# EAGLE design SQUAREPOWERVerticalUSBCV1 (EAGLE 9.6.2)
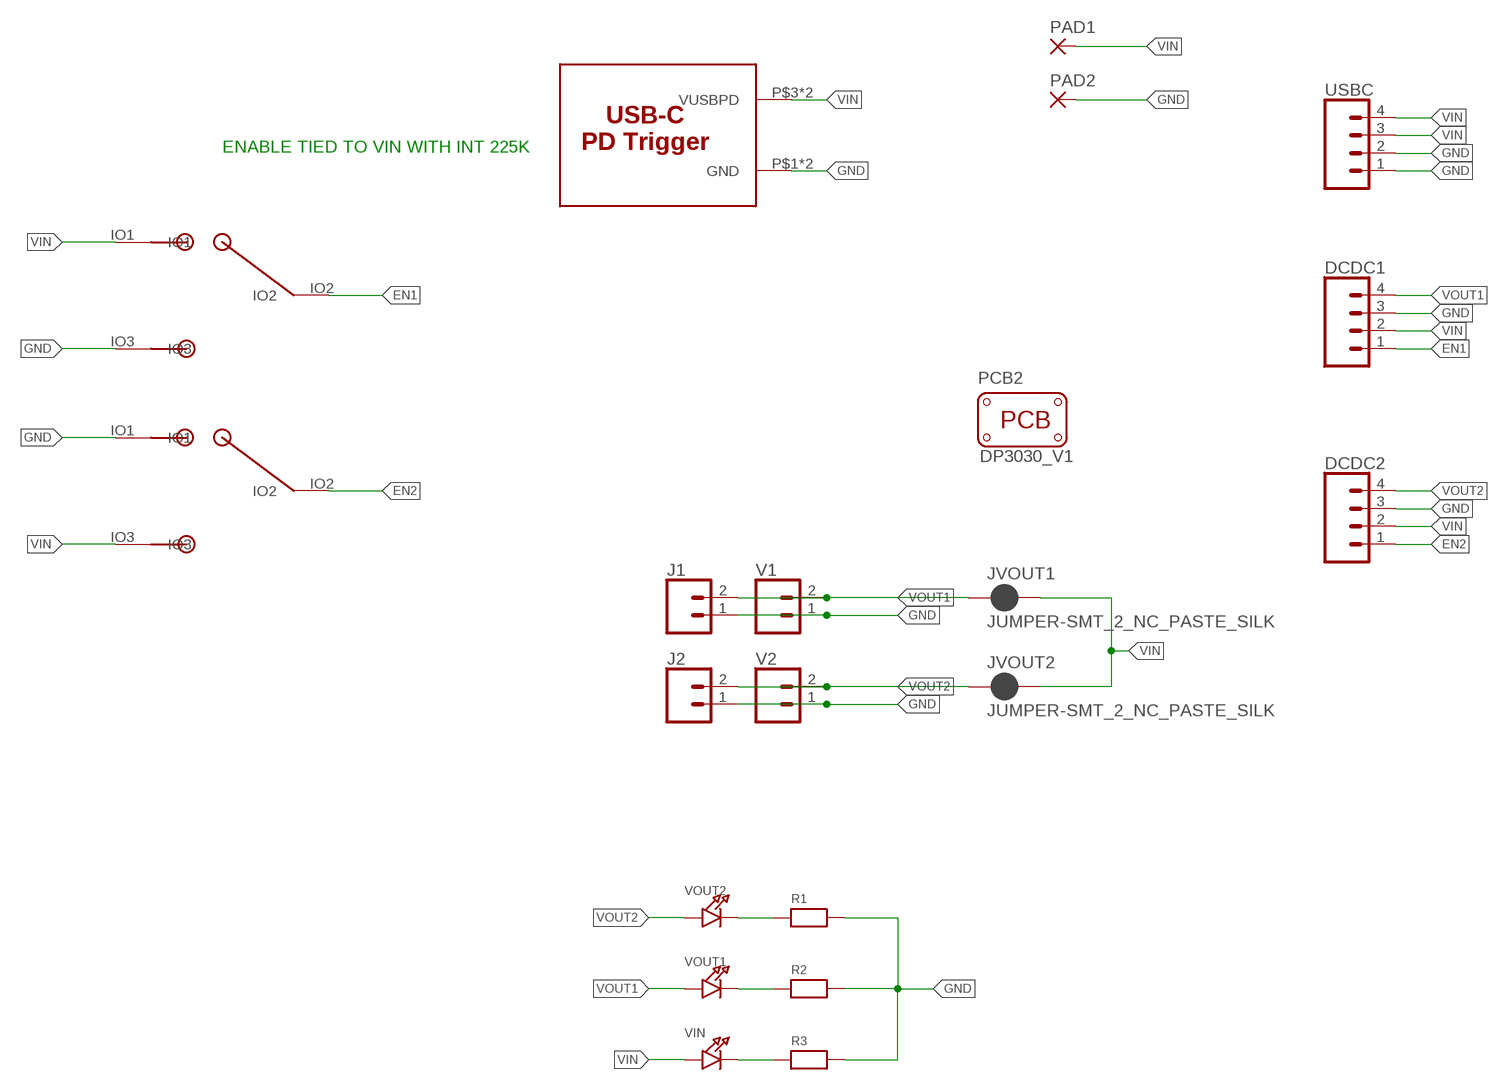
[diagram p0: schematic, sheet 1]

## Parts
DCDC1  CONN_04LONGPADS  [1X04_LONGPADS]
DCDC2  CONN_04LONGPADS  [1X04_LONGPADS]
J1  CONN_02  [1X02]
J2  CONN_02  [1X02]
JVOUT1  JUMPER-SMT_2_NC_PASTE_SILK  [SMT-JUMPER_2_NC_PASTE_SILK]
JVOUT2  JUMPER-SMT_2_NC_PASTE_SILK  [SMT-JUMPER_2_NC_PASTE_SILK]
PAD1  SMD5  [SMD2,54-5,08]
PAD2  SMD5  [SMD2,54-5,08]
PCB2  PCB_DP_SQUARE-3X3  [DP3030_V1]
R1  RESISTOR0805  [0805]
R2  RESISTOR0805  [0805]
R3  RESISTOR0805  [0805]
U$1  SPDT-SWITCH-MSKT-12C00  [MSKT-12C00]
U$2  SPDT-SWITCH-MSKT-12C00  [MSKT-12C00]
U$5  USB_PD_TRIGGER  [USB-PDTRIGGER]
USBC  CONN_04LONGPADS  [1X04_LONGPADS]
V1  CONN_023.5MM  [SCREWTERMINAL-3.5MM-2]
V2  CONN_023.5MM  [SCREWTERMINAL-3.5MM-2]
VIN  LED0805  [CHIPLED_0805]
VOUT1  LED0805  [CHIPLED_0805]
VOUT2  LED0805  [CHIPLED_0805]

## Nets
EN1: DCDC1.1 U$1.IO2
EN2: DCDC2.1 U$2.IO2
GND: DCDC1.3 DCDC2.3 J1.1 J2.1 PAD2.1(P) R1.2 R2.2 R3.2 U$1.IO3 U$2.IO1 U$5.P$1(GND) U$5.P$2(GND) USBC.1 USBC.2 V1.1 V2.1
N$1: R1.1 VOUT2.C
N$2: R2.1 VOUT1.C
N$3: R3.1 VIN.C
VIN: DCDC1.2 DCDC2.2 JVOUT1.2 JVOUT2.2 PAD1.1(P) U$1.IO1 U$2.IO3 U$5.P$3(VUSBPD) U$5.P$4(VUSBPD) USBC.3 USBC.4 VIN.A
VOUT1: DCDC1.4 J1.2 JVOUT1.1 V1.2 VOUT1.A
VOUT2: DCDC2.4 J2.2 JVOUT2.1 V2.2 VOUT2.A

## Notes on the sheet
- ENABLE TIED TO VIN WITH INT 225K

## Library data of the parts
DCDC1 DCDC2 USBC = SparkFun-Connectors:CONN_04: Multi connection point. Often used as Generic Header-pin footprint for 0.1 inch spaced/style header connections On any of the 0.1 inch spaced packages, you can populate with these: Break Away Headers - Straight <https://www.sparkfun.com/products/116> (PRT-00116) Break Away Male Headers - Right Angle <https://www.sparkfun.com/products/553> (PRT-00553) Female Headers <https://www.sparkfun.com/products/115> (PRT-00115) Break Away Headers - Machine Pin <https://www.sparkfun.com/products/117> (PRT-00117) Break Away Female Headers - Swiss Machine Pin <https://www.sparkfun.com/products/743> (PRT-00743) For SCREWTERMINALS and SPRING TERMINALS visit here: Screw Terimnals on SparkFun.com <https://www.sparkfun.com/search/results?term=Screw+Terminals> (5mm/3.5mm/2.54mm spacing) This device is also useful as a general connection point to wire up your design to another part of your project. Our various solder wires solder well into these plated through hole pads. Hook-Up Wire - Assortment (Stranded, 22 AWG) <https://www.sparkfun.com/products/11375> (PRT-11375) Hook-Up Wire - Assortment (Solid Core, 22 AWG) <https://www.sparkfun.com/products/11367> (PRT-11367) View the entire wire category on our website here <https://www.sparkfun.com/categories/141> Special notes: Molex polarized connector foot print use with SKU : PRT-08231 with associated crimp pins and housings. 1MM SMD Version SKU: PRT-10208; PROD_ID: CONN-09696
J1 J2 = SparkFun-Connectors:CONN_02: Multi connection point. Often used as Generic Header-pin footprint for 0.1 inch spaced/style header connections On any of the 0.1 inch spaced packages, you can populate with these: Break Away Headers - Straight <https://www.sparkfun.com/products/116> (PRT-00116) Break Away Male Headers - Right Angle <https://www.sparkfun.com/products/553> (PRT-00553) Female Headers <https://www.sparkfun.com/products/115> (PRT-00115) Break Away Headers - Machine Pin <https://www.sparkfun.com/products/117> (PRT-00117) Break Away Female Headers - Swiss Machine Pin <https://www.sparkfun.com/products/743> (PRT-00743) For SCREWTERMINALS and SPRING TERMINALS visit here: Screw Terimnals on SparkFun.com <https://www.sparkfun.com/search/results?term=Screw+Terminals> (5mm/3.5mm/2.54mm spacing) This device is also useful as a general connection point to wire up your design to another part of your project. Our various solder wires solder well into these plated through hole pads. Hook-Up Wire - Assortment (Stranded, 22 AWG) <https://www.sparkfun.com/products/11375> (PRT-11375) Hook-Up Wire - Assortment (Solid Core, 22 AWG) <https://www.sparkfun.com/products/11367> (PRT-11367) View the entire wire category on our website here <https://www.sparkfun.com/categories/141> Special notes: Molex polarized connector foot print use with: PRT-08233 with associated crimp pins and housings. 2.54_SCREWTERM for use with PRT-10571. 3.5mm Screw Terminal footprints for PRT-08084 5mm Screw Terminal footprints for use with PRT-08432
JVOUT1 JVOUT2 = SparkFun-Jumpers:JUMPER-SMT_2_NC_PASTE: Normally closed solder jumper This jumper has an aperture in the stencil to allow solder paste to bridge the split in the wire so it's normally closed (NC). Wick off the solder to open the connection. Reapply solder to reclose the connection.
PAD1 PAD2 = wirepad:SMD5: SMD PAD
PCB2 = dp_devices:PCB_DP_SQUARE: Dangerous Prototypes Standard Square PCB sizes; PCB_SIZE: DP3030_V1
R1-R3 = microbuilder:RESISTOR: Resistors 0402 - 0402 Surface Mount Package 22 Ohm 1% 1/16W [Digikey: 311-22.0LRTR-ND] 33 Ohm 5% 1/16W 1.0K 5% 1/16W 1.5K 5% 1/16W 2.0K 1% 1/16W 10.0K 1% 1/16W [Digikey: 311-10.0KLRTR-ND] 10.0K 5% 1/16W [Digikey: RMCF0402JT10K0TR-ND] 12.1K 1% 1/16W [Digikey: 311-22.0LRTR-ND] 100.0K 5% 1/16W 0603 - 0603 Surface Mount Package 0 Ohm 1/10 Watt 1% Resistor 15 Ohm 1/10 Watt 1% Resistor 33 Ohm 1/10 Watt 1% Resistor 49.9 Ohm 1/10 Watt 1% Resistor 100 Ohm 1/10 Watt 1% Resistor 150 Ohm 1/10 Watt 1% Resistor 240 Ohm 1/10 Watt 1% Resistor 390 Ohm 1/10 Watt 1% Resistor 560 Ohm 1/10 Watt 1% Resistor 680 Ohm 1/10 Watt 1% Resistor 750 Ohm 1/10 Watt 1% Resistor 1.0K Ohm 1/10 Watt 1% Resistor 1.5K Ohm 1/10 Watt 1% Resistor 2.0K Ohm 1/10 Watt 1% Resistor 2.2K Ohm 1/10 Watt 1% Resistor 3.3K Ohm 1/10 Watt 1% Resistor 4.7K Ohm 1/10 Watt 1% Resistor 10.0K Ohm 1/10 Watt 1% Resistor 12.0K Ohm 1/10 Watt 1% Resistor 12.1K Ohm 1/10 Watt 1% Resistor 20.0K Ohm 1/10 Watt 1% Resistor 33.0K Ohm 1/10 Watt 1% Resistor 100.0K Ohm 1/10 Watt 1% Resistor 0805 - 0805 Surface Mount Package 0 Ohm 1/8 Watt 1% Resistor 33 Ohm 1/8 Watt 1% Resistor 100 Ohm 1/8 Watt 1% Resistor 150 Ohm 1/8 Watt 1% Resistor 200 Ohm 1/8 Watt 1% Resistor 240 Ohm 1/8 Watt 1% Resistor 330 Ohm 1/8 Watt 1% Resistor 390 Ohm 1/8 Watt 1% Resistor 470 Ohm 1/8 Watt 1% Resistor 1.0K Ohm 1/8 Watt 1% Resistor 1.5K Ohm 1/8 Watt 1% Resistor 2.0K Ohm 1/8 Watt 1% Resistor 4.7K Ohm 1/8 Watt 1% Resistor 5.1K Ohm 1/8 Watt 1% Resistor 5.6K Ohm 1/8 Watt 1% Resistor 10.0K Ohm 1/8 Watt 1% Resistor 22.0K Ohm 1/8 Watt 1% Resistor 33.0K Ohm 1/8 Watt 1% Resistor 100K Ohm 1/8 Watt 1% Resistor 1206 - 1206 Surface Mount Package 2012 - 2010 Surface Mount Package 0.11 Ohm 1/2 Watt 1% Resistor - Digikey: RHM.11UCT-ND
U$1 U$2 = MyBreadBoards:SPDT-SWITCH-MSKT-12C00
U$5 = MyBreadBoards:USB_PD_TRIGGER
V1 V2 = SparkFun-Connectors:CONN_02: Multi connection point. Often used as Generic Header-pin footprint for 0.1 inch spaced/style header connections On any of the 0.1 inch spaced packages, you can populate with these: Break Away Headers - Straight <https://www.sparkfun.com/products/116> (PRT-00116) Break Away Male Headers - Right Angle <https://www.sparkfun.com/products/553> (PRT-00553) Female Headers <https://www.sparkfun.com/products/115> (PRT-00115) Break Away Headers - Machine Pin <https://www.sparkfun.com/products/117> (PRT-00117) Break Away Female Headers - Swiss Machine Pin <https://www.sparkfun.com/products/743> (PRT-00743) For SCREWTERMINALS and SPRING TERMINALS visit here: Screw Terimnals on SparkFun.com <https://www.sparkfun.com/search/results?term=Screw+Terminals> (5mm/3.5mm/2.54mm spacing) This device is also useful as a general connection point to wire up your design to another part of your project. Our various solder wires solder well into these plated through hole pads. Hook-Up Wire - Assortment (Stranded, 22 AWG) <https://www.sparkfun.com/products/11375> (PRT-11375) Hook-Up Wire - Assortment (Solid Core, 22 AWG) <https://www.sparkfun.com/products/11367> (PRT-11367) View the entire wire category on our website here <https://www.sparkfun.com/categories/141> Special notes: Molex polarized connector foot print use with: PRT-08233 with associated crimp pins and housings. 2.54_SCREWTERM for use with PRT-10571. 3.5mm Screw Terminal footprints for PRT-08084 5mm Screw Terminal footprints for use with PRT-08432; PROD_ID: CONN-08399
VIN VOUT1 VOUT2 = microbuilder:LED: LED 0603 - 0603 Surface Mount Package 2mA: Green LED - Low Power (3.9mcd, 2ma, 1.7Vf) - Digikey: 475-2709-2-ND Orange LED - Low Power (9.8mcd, 2ma, 1.8Vf) - Digikey: 475-1194-2-ND Red LED - Low Power (5mcd, 2ma, 1.8Vf) - Digikey: 475-1195-2-ND Yellow LED - Low Power (7mcd, 2ma, 1.8Vf) - Digikey: 475-1196-2-ND 5mA: Blue LED - Low Power (17mcd, 5ma, 2.9Vf) - Digikey: LNJ937W8CRACT-ND 0805 - 0805 Surface Mount Package 2mA: Red LED (8.8mcd, 2mA, 1.8Vf, Clear) - Low Power [Digikey: 475-2510-1-ND] Green LED (5mcd, 2mA, 1.8Vf, Clear) - Low Power [Digikey: 475-2730-1-ND] Yellow LED (11.3mcd, 2mA, 1.8Vf, Clear) - Low Power [Digikey: 475-2555-1-ND] 20mA: Red LED (104mcd, 20mA, Diffused) - LS R976 [Digikey: 475-1278-6-ND] Red LED (12mcd, 20mA, 2.0Vf, Clear) - APT2012EC [Digikey: 754-1128-1-ND] Green LED (15mcd, 20mA, 2.2Vf, Clear) - APT2012GC [Digikey: 754-1131-1-ND] Orange LED (160mcd, 20mA, 2.1Vf, Clear) - APT2012SECK [Digikey: 754-1130-1-ND] 1206 - 1206 Surface Mount Package Green LED (26mcd, 20mA, Diffused) - LG N971 [Digikey: 475-1407-6-ND] Red LED (15mcd, 20mA, Diffused) - LH N974 [Digikey: 475-1416-6-ND]

## Board
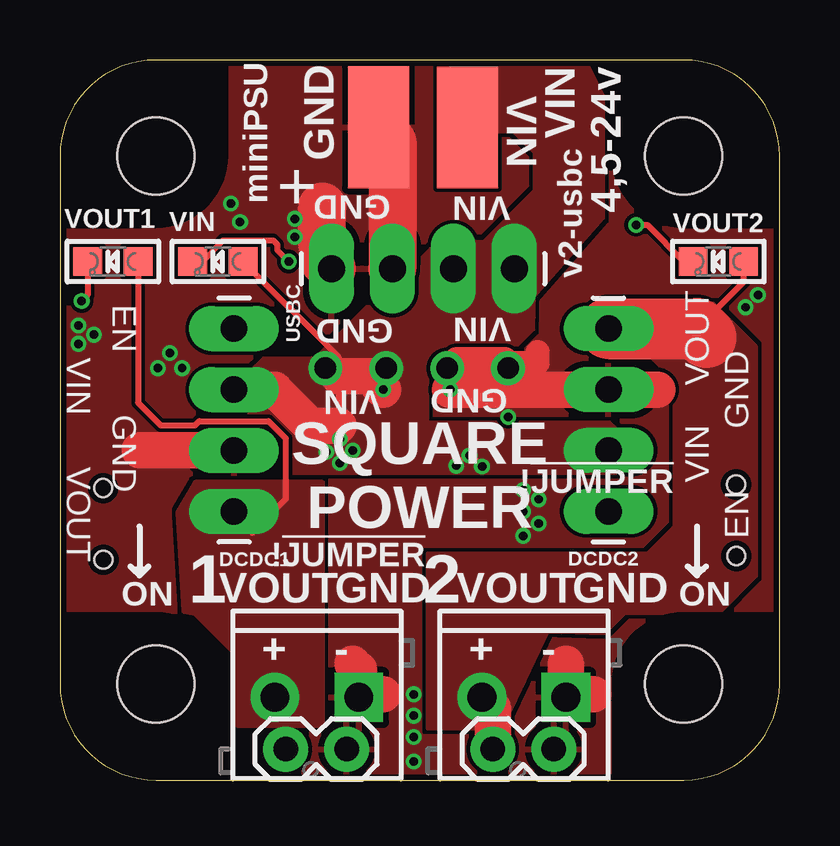
[diagram p1: board, top side]
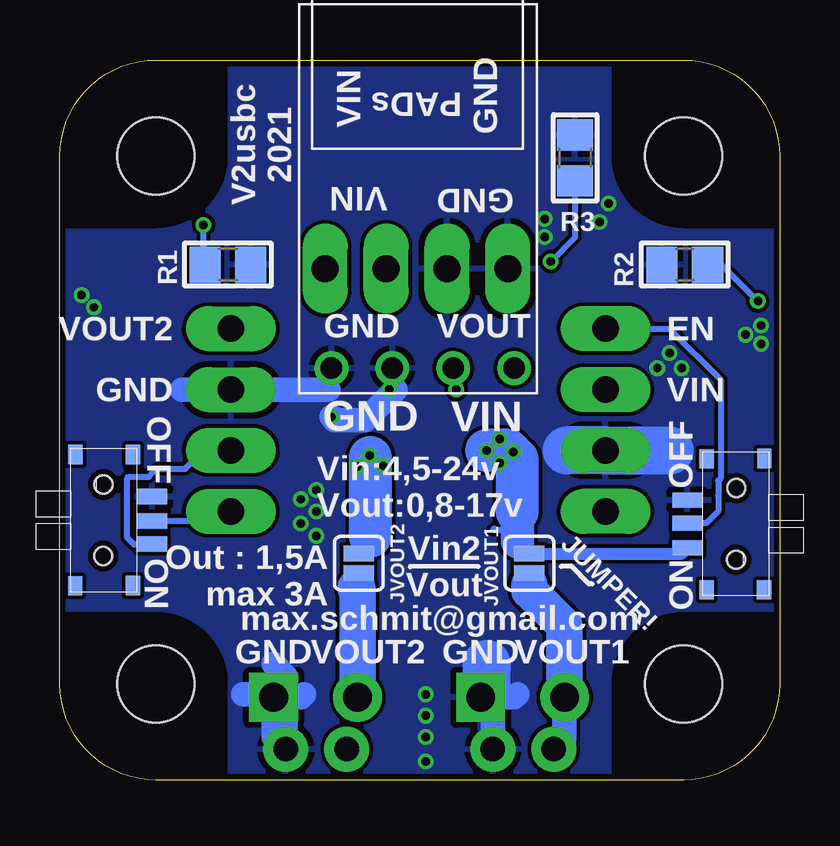
[diagram p2: board, bottom side, seen from below]

Size 30 x 30 mm. Coordinates in mm from the lower left corner, seen from the top.
Copper layers (1*16): Top 0.035mm / dielectric 1.5mm / Bottom 0.035mm
Design rules "dirt_cheap_dirty_boards.v1.1": minimum track width 6mil, minimum drill 12mil, track to track 6mil, track to pad 6mil, pad to pad 6mil, via to via 6mil, smd to smd 0mil, copper to edge 10mil, drill to drill 10mil, minimum pad ring 10mil, minimum via ring 6mil, stop-mask expansion 2mil, vias tented up to drill 25mil, thermal gap 10mil

### Footprints (pad centres in the part's own frame; a part is rotated, then mirrored left to right if it is on the bottom)
1X04_LONGPADS = drill 1.118 pad 1.88 long: 1 0,0; 2 2.54,0; 3 5.08,0; 4 7.62,0
1X02 = drill 1.016 pad 1.88: 1 0,0; 2 2.54,0
SMT-JUMPER_2_NC_PASTE_SILK = smd 0.635 x 1.27: 1 -0.406,0; 2 0.406,0
SMD2,54-5,08 = smd 2.54 x 5.08: 1 0,0
DP3030_V1 = hole 3.2: -11,-11; 11,-11; 11,11; -11,11
0805 = smd 1.3 x 1.5: 1 -0.95,0; 2 0.95,0
MSKT-12C00 = smd 0.635 x 1.27: IO1 -1.003,3.439; IO2 0.017,3.439; IO3 0.977,3.439 | smd 0.8 x 0.6: IO4 -2.753,2.639; IO5 -2.753,0.249; IO6 2.717,0.239; IO7 2.707,2.639 | hole 0.75: 1.477,1.409; -1.503,1.419
USB-PDTRIGGER = drill 0.9: P$1 -3.683,-0.254; P$2 -1.143,-0.254; P$3 1.397,-0.254; P$4 3.937,-0.254
SCREWTERMINAL-3.5MM-2 = drill 1.2 pad 2.032 square: 1 0,0 | drill 1.2 pad 2.032: 2 3.5,0
CHIPLED_0805 = smd 1.2 x 1.2: A 0,-1.05; C 0,1.05

### Placement (x,y rotation side)
DCDC1  7.25,18.81 270 top
DCDC2  22.87,11.19 90 top
J1  11.95,1.28 180 top
J2  20.59,1.28 180 top
JVOUT1  10.43,9.03 90 bottom
JVOUT2  17.54,9.03 90 bottom
PAD1  17,27.19 0 top
PAD2  13.28,27.2 0 top
PCB2  15,15 0 top
R1  23,21.48 0 bottom
R2  3.95,21.48 180 bottom
R3  8.52,25.92 90 bottom
U$1  0.39,10.68 90 bottom
U$2  29.61,10.81 270 bottom
U$5  15,17.41 0 bottom
USBC  11.32,21.31 0 top
V1  12.46,3.44 180 top
V2  21.1,3.44 180 top
VIN  6.58,21.6 90 top
VOUT1  2.2,21.6 90 top
VOUT2  27.45,21.6 90 top

### Tracks (layer width: path | path; a pad name or v marks a point on that pad's centre or on a via)
EN1
  Bottom 0.254: DCDC1.1 4.59,18.81 2.46,16.68 2.46,12.58 2.56,12.47 2.56,11.85 2.55,11.84 2.55,11.19 3.04,10.7 U$1.IO2
EN2
  Bottom 0.254: U$2.IO2 23.27,10.79
  Bottom 0.508: 23.27,10.79 DCDC2.1
GND  (via drill 0.35)
  Top 1: U$5.P$1 18.91,17.38 19.92,17.38 19.92,17.82
  Top 1.016: U$5.P$2 16.52,17.54 18.56,17.54 18.68,17.41 U$5.P$1
  Top 1.524: v16.27,16.27 DCDC2.3 24.91,16.27 | DCDC1.3 3.32,13.73 | 12.46,4.59 12.21,4.84 | V1.1 12.59,3.57 13.48,3.57 | 21.1,4.84 V2.1 21.22,3.57 22.24,3.57
  Top 2: PAD2.1 13.86,26.61 USBC.2 | USBC.1 11.02,21.61 11.02,22.22 10.94,22.3 10.94,23.89
  Bottom 1.016: v18.68,15.13 18.56,15 17.29,15 16.02,16.27 | 18.81,16.27 DCDC2.3 24.91,16.27 | J1.1 11.95,2.93 V1.1 | V1.1 12.59,3.57 | V2.1 21.1,1.79 J2.1 20.59,4.33 21.1,4.84 | V2.1 21.22,3.57 22.37,3.57 | V1.1 11.06,3.44 10.94,3.57 | V2.1 19.95,3.44 19.83,3.57
  Bottom 2: 4.59,13.73 DCDC1.3 8.88,13.73 | V1.1 12.21,3.7 12.21,4.84
  other vias: 19.32,12.08 19.32,11.19 19.32,10.17 19.95,10.68 19.95,11.7 14.75,0.78 14.75,1.79 14.75,2.68 14.75,3.57 0.78,18.94 0.78,18.17 1.41,18.56 28.59,19.7 29.1,20.21 7.51,23.26 7.13,24.02 9.79,22.62 9.79,23.38 4.59,17.79 5.09,17.16 4.08,17.16
  pour Top (rank 2): -4.05,32.78 -4.05,-0.24 -1.38,-2.91 30.37,-2.91 33.03,-0.24 33.03,33.92 32.27,34.68 -2.53,34.68 -4.18,33.03
  pour Bottom: -4.05,31.51 -4.05,-1.51 -1.38,-4.18 30.37,-4.18 33.03,-1.51 33.03,32.65 32.27,33.41 -2.53,33.41 -4.18,31.76
N$1  (via drill 0.35)
  Top 0.254: v24.02,23.13 24.49,23.13 26.02,21.6 VOUT2.C
  Bottom 0.254: R1.1 24.02,21.54 v24.02,23.13
N$2  (via drill 0.35)
  Top 0.254: VOUT1.C 1.16,20.2 v0.9,19.95
  Bottom 0.254: v0.9,19.95 2.43,21.48 R2.1
N$3  (via drill 0.35)
  Top 0.254: VIN.C 5.92,21.6 6.8,22.48 8.89,22.48 9.05,22.32 9.05,22.09 v9.54,21.6
  Bottom 0.254: R3.1 8.52,22.62 v9.54,21.6
VIN  (via drill 0.35)
  Top 0.2: v16.53,13.1 16.95,13.52 v17.08,13.52 17.14,13.52 v17.6,13.07
  Top 0.254: VIN.A 11.61,17.63 11.61,16.82 11.61,14.76
  Top 1.524: DCDC1.2 8.94,16.27 10.45,14.76 11.61,14.76 | 11.61,16.82 12.93,16.82 v13.48,16.27
  Bottom 0.2: 17.06,13.44 17.06,13.5 v17.08,13.52
  Bottom 0.254: 10.92,9.93 JVOUT1.2 11.42,10.43 11.95,10.43 11.89,10.49 | U$2.IO3 26.18,9.81 26.92,9.81 27.19,10.09 27.19,12.59 27.15,12.63 26.3,12.63 25.96,12.97 24.78,12.97 24.02,13.73
  Bottom 0.508: JVOUT2.2 17.54,9.69 17.06,10.17 | JVOUT1.2 4.08,9.44 U$1.IO1 | 24.25,13.73 24.02,13.73 DCDC2.2
  Bottom 1.4: 10.92,9.93 10.94,9.95 10.94,11.19
  Bottom 1.8: 10.94,11.19 10.94,13.35 11.32,13.73 11.65,13.73 | 11.65,13.73 11.66,13.74 | 17.06,10.17 17.06,13.44 | 11.65,13.73 v12.21,13.73
  other vias: 11.66,14.21 11.66,13.21 11.11,13.66
  pour Top (no thermals): 8.52,17.54 10.68,17.54 14.49,21.35 19.06,21.35 19.7,20.71 19.7,19.26 18.68,18.24 15.95,18.24 15.25,17.54 15.25,14.87 22.87,14.87 23.13,14.62 23.13,12.82 9.47,12.82 7.95,13.97 7.95,16.97
  pour Top (no thermals): 19.7,18.82 19.7,20.16 22.62,23.46 22.62,28.46 21.98,29.73 16.4,29.73 15.89,29.22 15.89,27.06 18.94,27.06 19.83,26.18 19.83,24.52 17.67,22.37 15.76,22.37 14.87,21.48 14.87,18.68 15.63,17.92 18.8,17.92
VOUT1
  Top 0.254: VOUT1.A 3.26,15.72 4.21,14.77 5.63,14.77 5.81,14.95 8.7,14.95 9.41,14.23 9.41,11.7 8.02,10.3
  Bottom 0.508: JVOUT1.1 10.43,7.89
  Bottom 1.016: J1.2 8.96,1.74 V1.2
  Bottom 1.524: V1.2 8.96,6.42 10.43,7.89 10.43,8.14
  pour Top (no thermals): 5.65,12.38 4.94,11.16 5.17,7.05 5.64,6.96 7.41,5.19 7.41,2.3 10.94,2.3 10.94,12.38
VOUT2
  Top 0.254: VOUT2.A 28.5,20.75 26.56,18.81
  Top 1.524: J2.2 18.05,2.99 V2.2
  Top 2.54: DCDC2.4 26.56,18.81 26.94,18.43
  Bottom 0.508: JVOUT2.1 17.6,8.57 17.6,7.94
  Bottom 1.524: V2.2 17.6,7.94 17.67,8.02
  pour Top (no thermals): 24.14,19.83 27.19,19.83 28.97,18.05 28.97,8.52 27.45,7 23.51,7 22.65,6.14 20.3,6.23 18.39,2.17 15.38,2.17 15.38,9.41 24.52,9.41 25.67,10.55 25.67,16.65 24.4,17.92 24.14,17.92 23.89,18.17 23.89,19.57

### Text on the board
tPlace: VIN / 4,5-24v | VIN | miniPSU | GND | GND | VIN | + | v2-usbc | VIN | EN | GND | VOUT | VIN | GND | GND | VIN | GND | VIN | SQUARE / POWER | !!JUMPER! | VOUT | EN | !!JUMPER! | 1 | VOUT | GND | 2 | VOUT | GND | ON | ON | + - | + -
bPlace: PADs | GND | VIN | V2usbc / 2021 | GND | VIN | EN | VOUT2 | VIN | GND | VIN | GND | OFF | OFF | Vin:4,5-24v / Vout:0,8-17v | Vin2 / Vout | Out : 1,5A / max 3A | ON | JUMPER! | ON | VOUT1 | GND | VOUT2 | GND | max.schmit@gmail.com